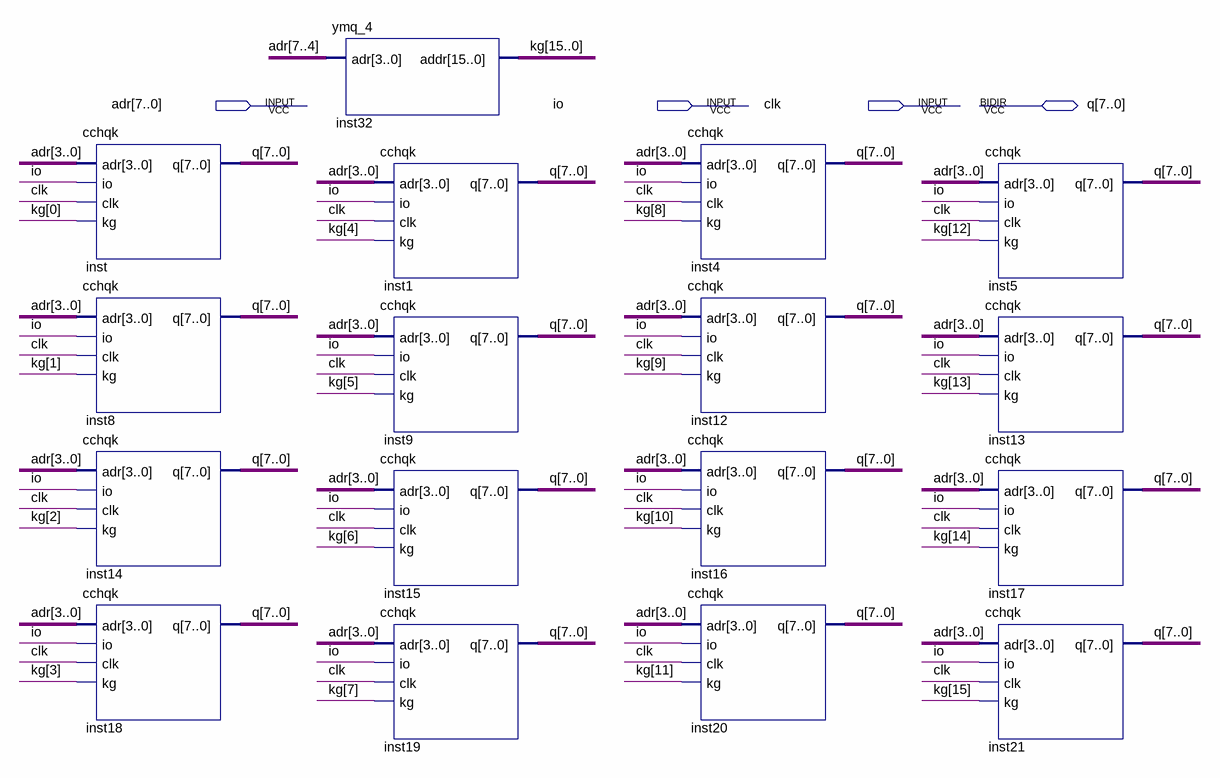
[diagram p0: schematic sheet]
// Quartus schematic cchq256.bdf as structural Verilog: 17 symbols, 4 pins
module cchq256 (
  input  [7:0] adr,
  input  io,
  input  clk,
  inout  [7:0] q
);

  wire [15:0] kg;

  cchqk inst (.adr(adr[3:0]), .io(io), .clk(clk), .kg(kg[0]), .q(q));
  cchqk inst8 (.adr(adr[3:0]), .io(io), .clk(clk), .kg(kg[1]), .q(q));
  cchqk inst14 (.adr(adr[3:0]), .io(io), .clk(clk), .kg(kg[2]), .q(q));
  cchqk inst18 (.adr(adr[3:0]), .io(io), .clk(clk), .kg(kg[3]), .q(q));
  ymq_4 inst32 (.adr(adr[7:4]), .addr(kg));
  cchqk inst1 (.adr(adr[3:0]), .io(io), .clk(clk), .kg(kg[4]), .q(q));
  cchqk inst9 (.adr(adr[3:0]), .io(io), .clk(clk), .kg(kg[5]), .q(q));
  cchqk inst15 (.adr(adr[3:0]), .io(io), .clk(clk), .kg(kg[6]), .q(q));
  cchqk inst19 (.adr(adr[3:0]), .io(io), .clk(clk), .kg(kg[7]), .q(q));
  cchqk inst4 (.adr(adr[3:0]), .io(io), .clk(clk), .kg(kg[8]), .q(q));
  cchqk inst12 (.adr(adr[3:0]), .io(io), .clk(clk), .kg(kg[9]), .q(q));
  cchqk inst16 (.adr(adr[3:0]), .io(io), .clk(clk), .kg(kg[10]), .q(q));
  cchqk inst20 (.adr(adr[3:0]), .io(io), .clk(clk), .kg(kg[11]), .q(q));
  cchqk inst5 (.adr(adr[3:0]), .io(io), .clk(clk), .kg(kg[12]), .q(q));
  cchqk inst13 (.adr(adr[3:0]), .io(io), .clk(clk), .kg(kg[13]), .q(q));
  cchqk inst17 (.adr(adr[3:0]), .io(io), .clk(clk), .kg(kg[14]), .q(q));
  cchqk inst21 (.adr(adr[3:0]), .io(io), .clk(clk), .kg(kg[15]), .q(q));
endmodule
